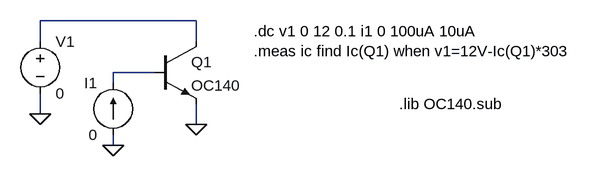
[diagram p0: schematic OC140.asc]
OC140.asc, the LTspice schematic file:
Version 4
SHEET 1 1624 680
WIRE 704 112 464 112
WIRE 464 144 464 112
WIRE 704 144 704 112
WIRE 640 192 576 192
WIRE 576 208 576 192
WIRE 464 256 464 224
WIRE 704 272 704 240
WIRE 576 304 576 288
FLAG 464 256 0
FLAG 576 304 0
FLAG 704 272 0
SYMBOL npn 640 144 R0
SYMATTR InstName Q1
SYMATTR Value OC140
SYMBOL voltage 464 128 R0
SYMATTR InstName V1
SYMATTR Value 0
SYMBOL current 576 288 R180
WINDOW 0 24 80 Left 2
WINDOW 3 24 0 Left 2
SYMATTR InstName I1
SYMATTR Value 0
TEXT 792 128 Left 2 !.dc v1 0 12 0.1 i1 0 100uA 10uA\n.meas ic find Ic(Q1) when v1=12V-Ic(Q1)*303
TEXT 1016 240 Left 2 !.lib OC140.sub

The netlist it stands for:
* OC140.asc
Q1 N001 N002 0 0 OC140
V1 N001 0 0
I1 0 N002 0
.model NPN NPN
.model PNP PNP
.lib standard.bjt
.dc v1 0 12 0.1 i1 0 100uA 10uA
.meas ic find Ic(Q1) when v1=12V-Ic(Q1)*303
.lib OC140.sub
.backanno
.end